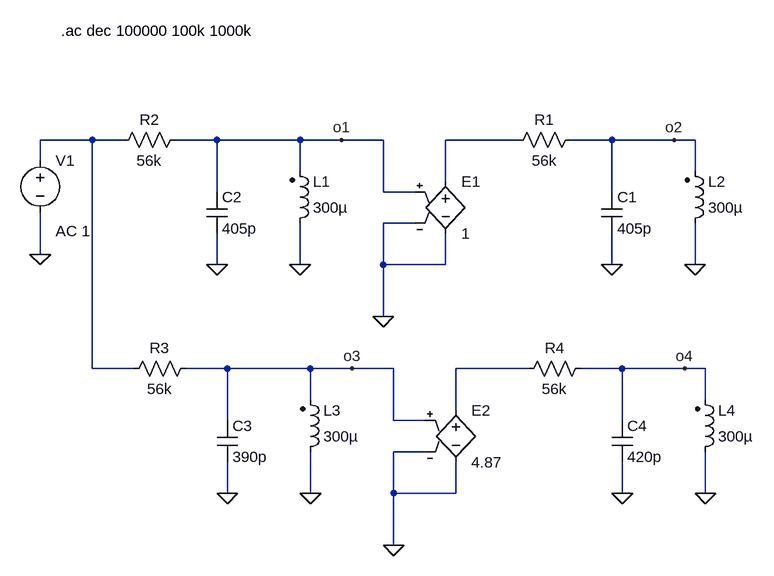
[diagram p0: schematic sinto simple2.asc]
sinto simple2.asc, the LTspice schematic file:
Version 4
SHEET 1 880 692
WIRE -304 48 -384 48
WIRE -256 48 -304 48
WIRE -112 48 -176 48
WIRE 16 48 -112 48
WIRE 80 48 16 48
WIRE 144 48 80 48
WIRE 352 48 240 48
WIRE 496 48 432 48
WIRE 592 48 496 48
WIRE 624 48 592 48
WIRE -384 80 -384 48
WIRE 16 96 16 48
WIRE 624 96 624 48
WIRE 240 112 240 48
WIRE -112 128 -112 48
WIRE 144 128 144 48
WIRE 192 128 144 128
WIRE 496 128 496 48
WIRE 192 176 144 176
WIRE -384 224 -384 160
WIRE -112 240 -112 192
WIRE 16 240 16 176
WIRE 144 240 144 176
WIRE 240 240 240 192
WIRE 240 240 144 240
WIRE 496 240 496 192
WIRE 624 240 624 176
WIRE 144 320 144 240
WIRE -304 400 -304 48
WIRE -240 400 -304 400
WIRE -96 400 -160 400
WIRE 32 400 -96 400
WIRE 96 400 32 400
WIRE 160 400 96 400
WIRE 368 400 256 400
WIRE 512 400 448 400
WIRE 608 400 512 400
WIRE 640 400 608 400
WIRE 32 448 32 400
WIRE 640 448 640 400
WIRE 256 464 256 400
WIRE -96 480 -96 400
WIRE 160 480 160 400
WIRE 208 480 160 480
WIRE 512 480 512 400
WIRE 208 528 160 528
WIRE -96 592 -96 544
WIRE 32 592 32 528
WIRE 160 592 160 528
WIRE 256 592 256 544
WIRE 256 592 160 592
WIRE 512 592 512 544
WIRE 640 592 640 528
WIRE 160 672 160 592
FLAG 16 240 0
FLAG -384 224 0
FLAG -112 240 0
FLAG 144 320 0
FLAG 624 240 0
FLAG 496 240 0
FLAG 592 48 o2
FLAG 80 48 o1
FLAG 32 592 0
FLAG -96 592 0
FLAG 160 672 0
FLAG 640 592 0
FLAG 512 592 0
FLAG 608 400 o4
FLAG 96 400 o3
SYMBOL res -160 32 R90
WINDOW 0 0 56 VBottom 2
WINDOW 3 32 56 VTop 2
SYMATTR InstName R2
SYMATTR Value 56k
SYMBOL voltage -384 64 R0
WINDOW 123 24 124 Left 2
WINDOW 39 0 0 Left 2
SYMATTR Value2 AC 1
SYMATTR InstName V1
SYMATTR Value ""
SYMBOL cap -128 128 R0
SYMATTR InstName C2
SYMATTR Value 405p
SYMBOL ind2 0 192 M180
WINDOW 0 36 80 Left 2
WINDOW 3 36 40 Left 2
SYMATTR InstName L1
SYMATTR Value 300µ
SYMBOL e 240 96 R0
SYMATTR InstName E1
SYMATTR Value 1
SYMBOL res 448 32 R90
WINDOW 0 0 56 VBottom 2
WINDOW 3 32 56 VTop 2
SYMATTR InstName R1
SYMATTR Value 56k
SYMBOL cap 480 128 R0
SYMATTR InstName C1
SYMATTR Value 405p
SYMBOL ind2 608 192 M180
WINDOW 0 36 80 Left 2
WINDOW 3 36 40 Left 2
SYMATTR InstName L2
SYMATTR Value 300µ
SYMBOL res -144 384 R90
WINDOW 0 0 56 VBottom 2
WINDOW 3 32 56 VTop 2
SYMATTR InstName R3
SYMATTR Value 56k
SYMBOL cap -112 480 R0
SYMATTR InstName C3
SYMATTR Value 390p
SYMBOL ind2 16 544 M180
WINDOW 0 36 80 Left 2
WINDOW 3 36 40 Left 2
SYMATTR InstName L3
SYMATTR Value 300µ
SYMBOL e 256 448 R0
SYMATTR InstName E2
SYMATTR Value 4.87
SYMBOL res 464 384 R90
WINDOW 0 0 56 VBottom 2
WINDOW 3 32 56 VTop 2
SYMATTR InstName R4
SYMATTR Value 56k
SYMBOL cap 496 480 R0
SYMATTR InstName C4
SYMATTR Value 420p
SYMBOL ind2 624 544 M180
WINDOW 0 36 80 Left 2
WINDOW 3 36 40 Left 2
SYMATTR InstName L4
SYMATTR Value 300µ
TEXT -352 -120 Left 2 !.ac dec 100000 100k 1000k

The netlist it stands for:
* sinto simple2.asc
R2 o1 N001 56k
V1 N001 0 AC 1
C2 o1 0 405p
L1 0 o1 300µ
E1 N002 0 o1 0 1
R1 o2 N002 56k
C1 o2 0 405p
L2 0 o2 300µ
R3 o3 N001 56k
C3 o3 0 390p
L3 0 o3 300µ
E2 N003 0 o3 0 4.87
R4 o4 N003 56k
C4 o4 0 420p
L4 0 o4 300µ
.ac dec 100000 100k 1000k
.backanno
.end